# Altium schematic sheet LCD.SchDoc
size 292 x 279 mm
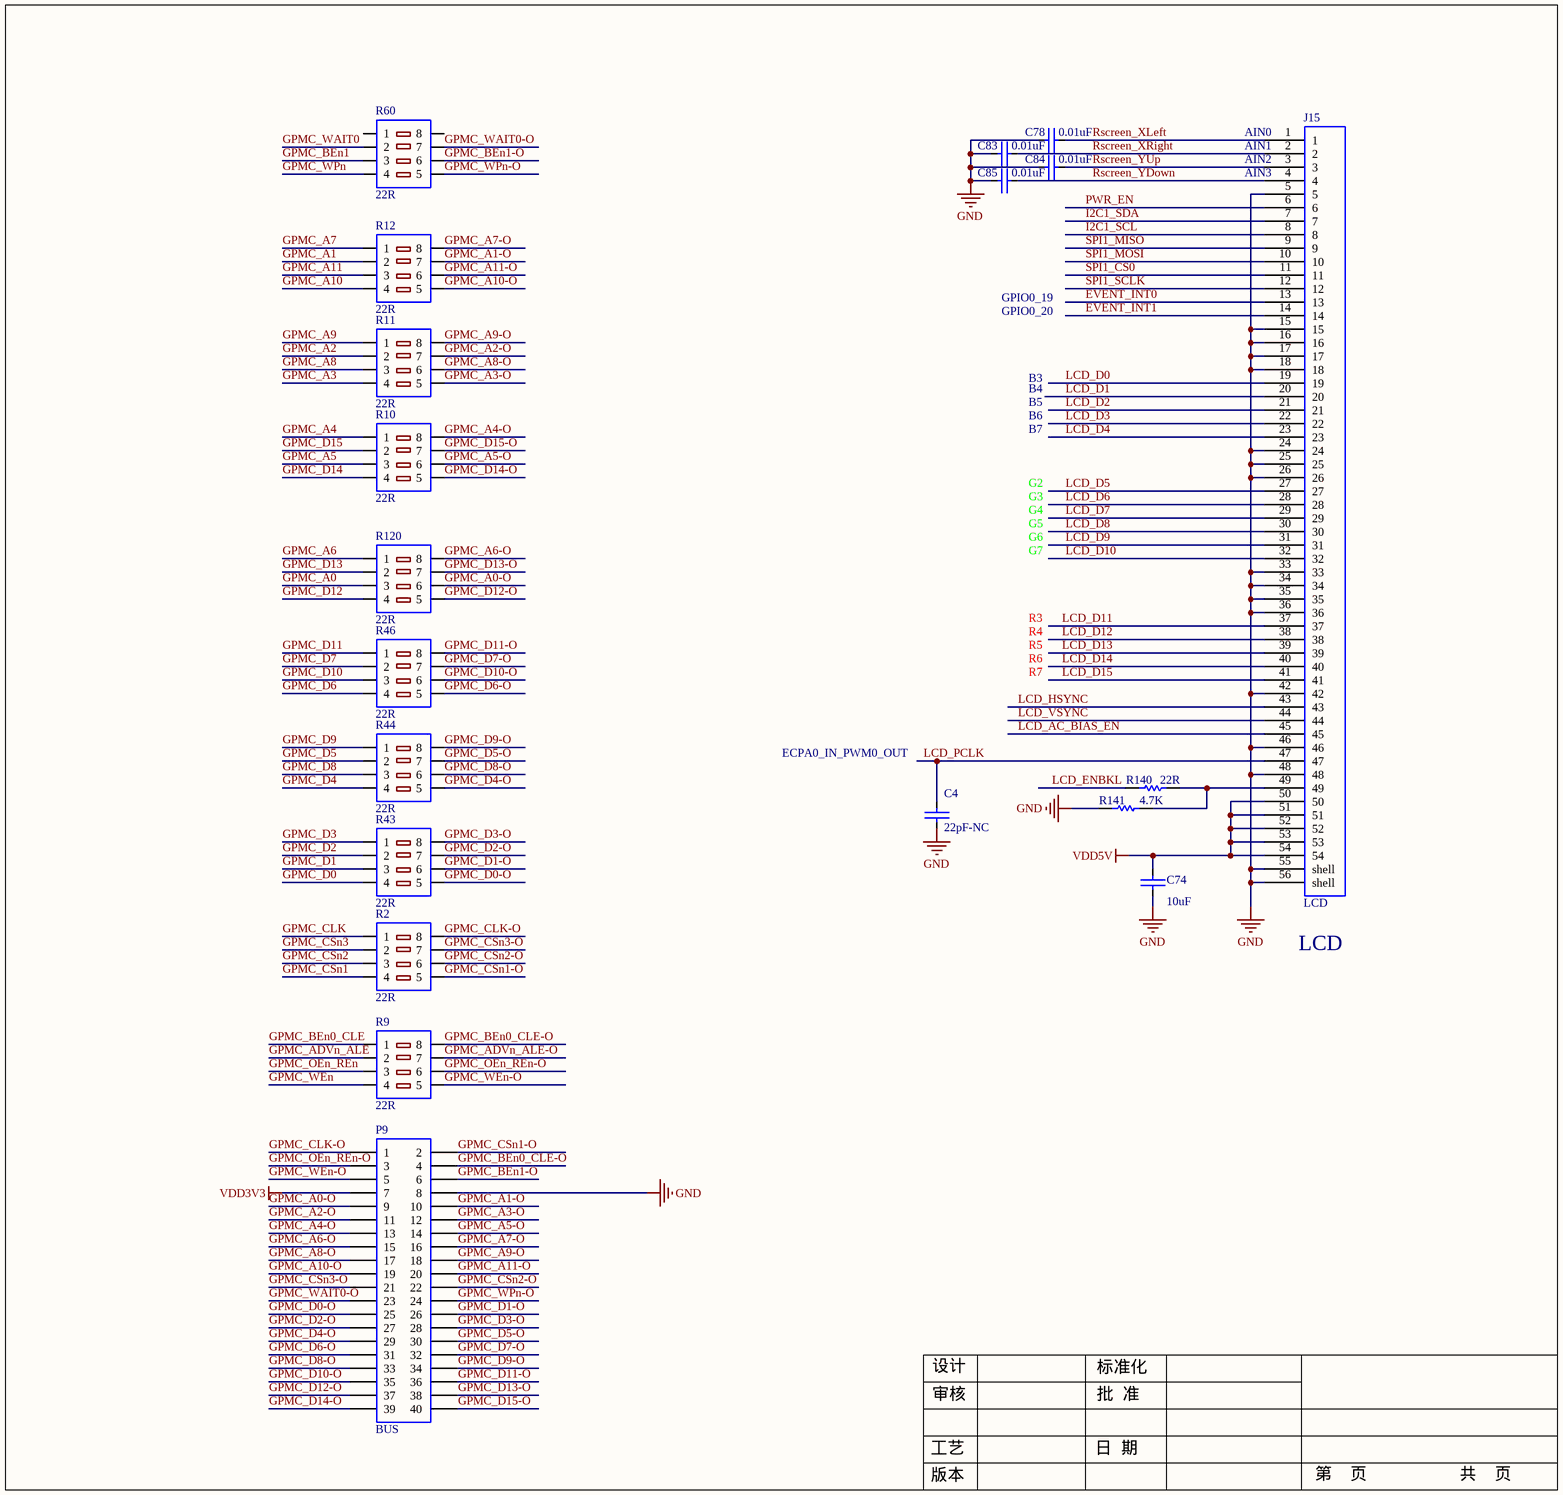
[diagram p0: LCD.SchDoc]

## Parts
C4  22pF-NC  [C0603_M1608]
C74  10uF  [C0603_M1608]
C78  0.01uF  [C0603_M1608]
C83  0.01uF  [C0603_M1608]
C84  0.01uF  [C0603_M1608]
C85  0.01uF  [C0603_M1608]
J15  LCD  [FPC54]
P9  BUS  [IDC40S]
R2  22R  [R0603-8P4R]
R9  22R  [R0603-8P4R]
R10  22R  [R0603-8P4R]
R11  22R  [R0603-8P4R]
R12  22R  [R0603-8P4R]
R43  22R  [R0603-8P4R]
R44  22R  [R0603-8P4R]
R46  22R  [R0603-8P4R]
R60  22R  [R0603-8P4R]
R120  22R  [R0603-8P4R]
R140  22R  [R0603_M1608]
R141  4.7K  [R0603_M1608]

## Nets
GND: C4.1 C74.2 C78.2 C83.2 C84.2 C85.2 J15.5 J15.15 J15.16 J15.17 J15.18 J15.24 J15.25 J15.26 J15.33 J15.34 J15.35 J15.36 J15.42 J15.46 J15.48 J15.55(shell) J15.56(shell) P9.8 R141.1
VDD3V3: P9.7
VDD5V: C74.1 J15.50 J15.51 J15.52 J15.53 J15.54
EVENT_INT0: J15.13
EVENT_INT1: J15.14
GPMC_A0: R120.3
GPMC_A0-O: P9.9 R120.6
GPMC_A1: R12.2
GPMC_A1-O: P9.10 R12.7
GPMC_A2: R11.2
GPMC_A2-O: P9.11 R11.7
GPMC_A3: R11.4
GPMC_A3-O: P9.12 R11.5
GPMC_A4: R10.1
GPMC_A4-O: P9.13 R10.8
GPMC_A5: R10.3
GPMC_A5-O: P9.14 R10.6
GPMC_A6: R120.1
GPMC_A6-O: P9.15 R120.8
GPMC_A7: R12.1
GPMC_A7-O: P9.16 R12.8
GPMC_A8: R11.3
GPMC_A8-O: P9.17 R11.6
GPMC_A9: R11.1
GPMC_A9-O: P9.18 R11.8
GPMC_A10: R12.4
GPMC_A10-O: P9.19 R12.5
GPMC_A11: R12.3
GPMC_A11-O: P9.20 R12.6
GPMC_ADVn_ALE: R9.2
GPMC_ADVn_ALE-O: R9.7
GPMC_BEn0_CLE: R9.1
GPMC_BEn0_CLE-O: P9.4 R9.8
GPMC_BEn1: R60.3
GPMC_BEn1-O: P9.6 R60.6
GPMC_CLK: R2.1
GPMC_CLK-O: P9.1 R2.8
GPMC_CSn1: R2.4
GPMC_CSn1-O: P9.2 R2.5
GPMC_CSn2: R2.3
GPMC_CSn2-O: P9.22 R2.6
GPMC_CSn3: R2.2
GPMC_CSn3-O: P9.21 R2.7
GPMC_D0: R43.4
GPMC_D0-O: P9.25 R43.5
GPMC_D1: R43.3
GPMC_D1-O: P9.26 R43.6
GPMC_D2: R43.2
GPMC_D2-O: P9.27 R43.7
GPMC_D3: R43.1
GPMC_D3-O: P9.28 R43.8
GPMC_D4: R44.4
GPMC_D4-O: P9.29 R44.5
GPMC_D5: R44.2
GPMC_D5-O: P9.30 R44.7
GPMC_D6: R46.4
GPMC_D6-O: P9.31 R46.5
GPMC_D7: R46.2
GPMC_D7-O: P9.32 R46.7
GPMC_D8: R44.3
GPMC_D8-O: P9.33 R44.6
GPMC_D9: R44.1
GPMC_D9-O: P9.34 R44.8
GPMC_D10: R46.3
GPMC_D10-O: P9.35 R46.6
GPMC_D11: R46.1
GPMC_D11-O: P9.36 R46.8
GPMC_D12: R120.4
GPMC_D12-O: P9.37 R120.5
GPMC_D13: R120.2
GPMC_D13-O: P9.38 R120.7
GPMC_D14: R10.4
GPMC_D14-O: P9.39 R10.5
GPMC_D15: R10.2
GPMC_D15-O: P9.40 R10.7
GPMC_OEn_REn: R9.3
GPMC_OEn_REn-O: P9.3 R9.6
GPMC_WAIT0: R60.2
GPMC_WAIT0-O: P9.23 R60.7
GPMC_WEn: R9.4
GPMC_WEn-O: P9.5 R9.5
GPMC_WPn: R60.4
GPMC_WPn-O: P9.24 R60.5
I2C1_SCL: J15.8
I2C1_SDA: J15.7
LCD_AC_BIAS_EN: J15.45
LCD_D0: J15.19
LCD_D1: J15.20
LCD_D2: J15.21
LCD_D3: J15.22
LCD_D4: J15.23
LCD_D5: J15.27
LCD_D6: J15.28
LCD_D7: J15.29
LCD_D8: J15.30
LCD_D9: J15.31
LCD_D10: J15.32
LCD_D11: J15.37
LCD_D12: J15.38
LCD_D13: J15.39
LCD_D14: J15.40
LCD_D15: J15.41
LCD_ENBKL: R140.1
LCD_HSYNC: J15.43
LCD_PCLK: C4.2 J15.47
LCD_VSYNC: J15.44
PWR_EN: J15.6
Rscreen_XLeft: C78.1 J15.1
Rscreen_XRight: C83.1 J15.2
Rscreen_YDown: C85.1 J15.4
Rscreen_YUp: C84.1 J15.3
SPI1_CS0: J15.11
SPI1_MISO: J15.9
SPI1_MOSI: J15.10
SPI1_SCLK: J15.12
NetJ15_49: J15.49 R140.2 R141.2

Not connected (* = marked no-connect by the designer): R60 1 8

## Notes on the sheet
- (near J15) AIN2
- (near J15) AIN1
- (near J15) AIN0
- (near J15) AIN3
- GPIO0_19
- GPIO0_20
- B3
- B4
- B5
- B7
- B6
- G2
- G3
- G4
- G5
- G7
- G6
- R3
- R4
- R5
- R7
- R6
- ECPA0_IN_PWM0_OUT
- (near J15) LCD
- 设计
- 标准化
- 审核
- 批  准
- 版本
- 工艺
- 日  期
- 第    页
- 共    页

## Library data of the parts
C4 C74 C78 C83-C85 = CAP_1: value: C0805
J15 = FPC54
P9 = Header 20X2: Header, 20-Pin, Dual row; LatestRevisionDate: 17-Jul-2002; LatestRevisionNote: Re-released for DXP Platform.; Publisher: Altium Limited
R2 R9-R12 R43 R44 R46 R60 R120 = 8P4R
R140 R141 = Res1: R0603; Published: 8-Jun-2000; LatestRevisionDate: 17-Jul-2002; LatestRevisionNote: Re-released for DXP Platform.; PackageReference: AXIAL-0.3; Publisher: Altium Limited; PackageDescription: Axial Device, Thru-Hole; 2 Leads; 0.3 in Pin Spacing; Value: R0603